# EAGLE design 5-channel-PWM (EAGLE 6.6.0)
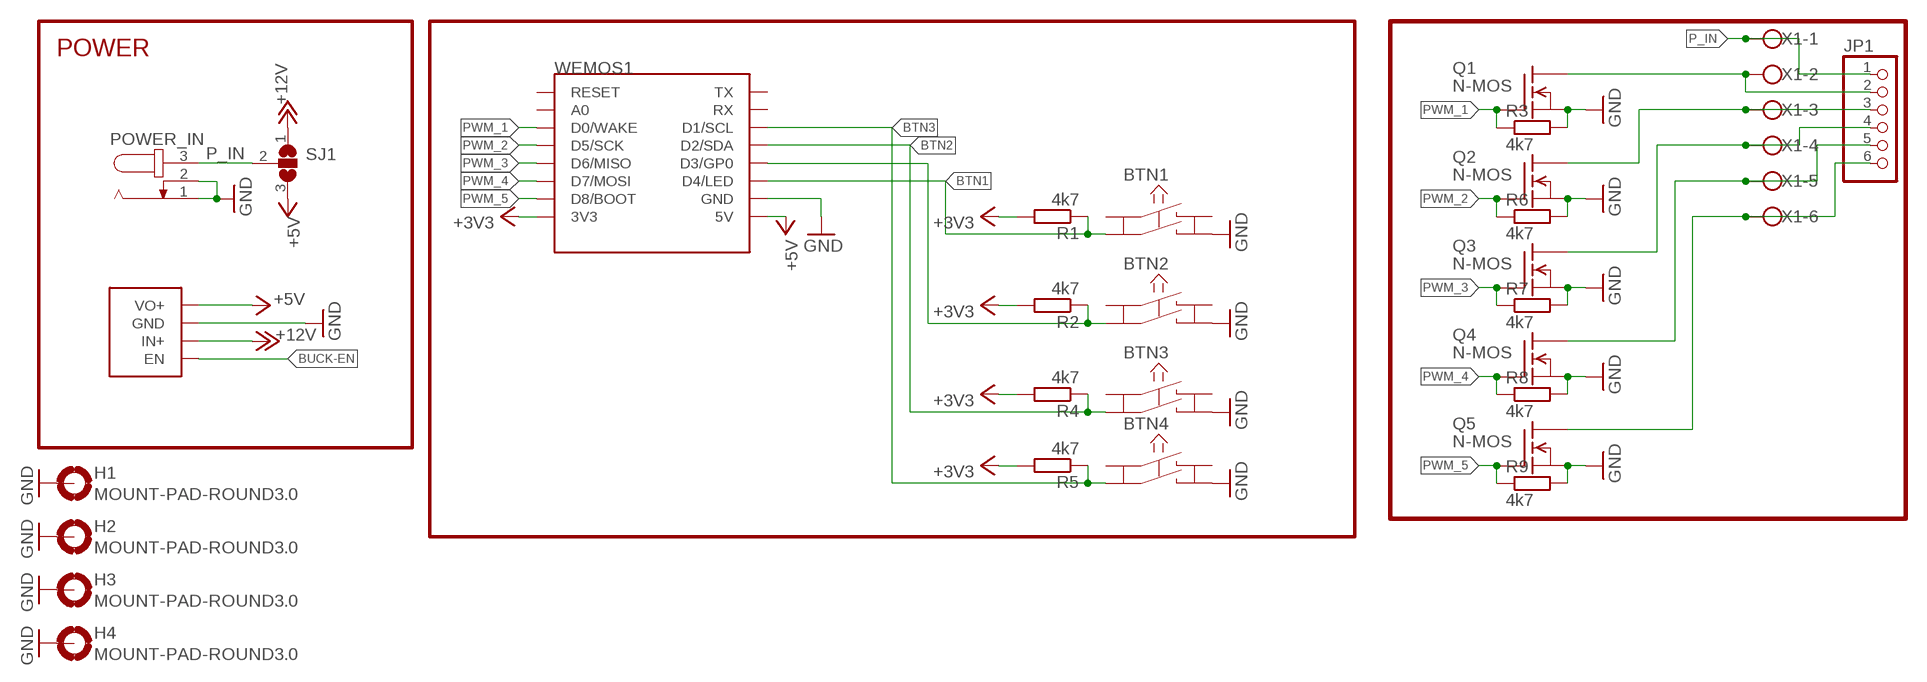
[diagram p0: schematic, sheet 1]

## Parts
BTN1  KSM611A  [KSM611A]
BTN2  KSM611A  [KSM611A]
BTN3  KSM611A  [KSM611A]
BTN4  KSM611A  [KSM611A]
H1  MOUNT-PAD-ROUND3.0  [3,0-PAD]
H2  MOUNT-PAD-ROUND3.0  [3,0-PAD]
H3  MOUNT-PAD-ROUND3.0  [3,0-PAD]
H4  MOUNT-PAD-ROUND3.0  [3,0-PAD]
JP1  PINHD-1X06_2.54-S  [1X06-S]
POWER_IN  RAPC7120  [RAPC712]
Q1  N-MOS  BUZ10  [TO220]
Q2  N-MOS  BUZ10  [TO220]
Q3  N-MOS  BUZ10  [TO220]
Q4  N-MOS  BUZ10  [TO220]
Q5  N-MOS  BUZ10  [TO220]
R1  4k7  R-EU_MULTI  [MULTI_RESISTOR]
R2  4k7  R-EU_MULTI  [MULTI_RESISTOR]
R3  4k7  R-EU_MULTI  [MULTI_RESISTOR]
R4  4k7  R-EU_MULTI  [MULTI_RESISTOR]
R5  4k7  R-EU_MULTI  [MULTI_RESISTOR]
R6  4k7  R-EU_MULTI  [MULTI_RESISTOR]
R7  4k7  R-EU_MULTI  [MULTI_RESISTOR]
R8  4k7  R-EU_MULTI  [MULTI_RESISTOR]
R9  4k7  R-EU_MULTI  [MULTI_RESISTOR]
SJ1  SJ2WW  [SJ_2W]
U$1  BUCK_CONVERTER_TE818  [BUCK_CONVERTER_TE818]
WEMOS1  WEMOS-D1-MINI  [WEMOS-D1-MINI]
X1  W237-136  [W237-136]

## Nets
+3V3: R1.2@1 R1.2@2 R2.2@1 R2.2@2 R4.2@1 R4.2@2 R5.2@1 R5.2@2 WEMOS1.3V3
+5V: SJ1.3 U$1.VO+ WEMOS1.5V
+12V: SJ1.1 U$1.IN+
BTN1: BTN1.C R1.1@1 R1.1@2 WEMOS1.D4(D4/LED)
BTN2: BTN3.C R4.1@1 R4.1@2 WEMOS1.D2(D2/SDA)
BTN3: BTN4.C R5.1@1 R5.1@2 WEMOS1.D1(D1/SCL)
BUCK-EN: U$1.EN
GND: BTN1.D BTN2.D BTN3.D BTN4.D H1.B3,0(MOUNT) H2.B3,0(MOUNT) H3.B3,0(MOUNT) H4.B3,0(MOUNT) POWER_IN.1 POWER_IN.2 Q1.3(S) Q2.3(S) Q3.3(S) Q4.3(S) Q5.3(S) R3.2@1 R3.2@2 R6.2@1 R6.2@2 R7.2@1 R7.2@2 R8.2@1 R8.2@2 R9.2@1 R9.2@2 U$1.GND WEMOS1.GND
N$1: JP1.2 Q1.2(D) X1.2
N$2: BTN2.C R2.1@1 R2.1@2 WEMOS1.D3(D3/GP0)
N$4: JP1.3 Q2.2(D) X1.3
N$5: JP1.4 Q3.2(D) X1.4
N$6: JP1.5 Q4.2(D) X1.5
N$9: JP1.6 Q5.2(D) X1.6
P_IN: JP1.1 POWER_IN.3 SJ1.2 X1.1
PWM_1: Q1.1(G) R3.1@1 R3.1@2 WEMOS1.D0(D0/WAKE)
PWM_2: Q2.1(G) R6.1@1 R6.1@2 WEMOS1.D5(D5/SCK)
PWM_3: Q3.1(G) R7.1@1 R7.1@2 WEMOS1.D6(D6/MISO)
PWM_4: Q4.1(G) R8.1@1 R8.1@2 WEMOS1.D7(D7/MOSI)
PWM_5: Q5.1(G) R9.1@1 R9.1@2 WEMOS1.D8(D8/BOOT)
Unconnected: BTN1.A BTN1.B BTN2.A BTN2.B BTN3.A BTN3.B BTN4.A BTN4.B WEMOS1.A0 WEMOS1.RESET WEMOS1.RX WEMOS1.TX

## Notes on the sheet
- POWER

## Library data of the parts
BTN1-BTN4 = schalter_taster:KSM611A
H1-H4 = holes:MOUNT-PAD-ROUND: MOUNTING PAD, round
JP1 = pinhead-2:PINHD-1X06: PIN HEADER
POWER_IN = Arduino Mega 2560:RAPC712: DC POWER JACK Power Jack, DC, Right Angle, Through Hole, Rated 5A at 16VDC, PC Terminals Distributor: Farnell (www.Farnell.de) Drawing: 84N1161.pdf / 84N1162.pdf Manufacturer: SPC Technology (www.spctechnology.com) Type: SPC4077 / SPC 4078
Q1-Q5 = transistor-fet:BUZ10: N-Channel Enhancement MOSFET 50V; 20A; 0,080Ohm
R1-R9 = diyHue:R-EU_MULTI
SJ1 = jumper:SJ2W: SMD solder JUMPER
U$1 = diyHue:BUCK_CONVERTER_TE818
WEMOS1 = esp8266modules:WEMOS-D1-MINI: WeMos.cc D1 mini ESP8266 module
X1 = con-wago-500:W237-136: WAGO SCREW CLAMP; MPN: 237-136; OC_FARNELL: unknown; OC_NEWARK: 84K9151

## Board
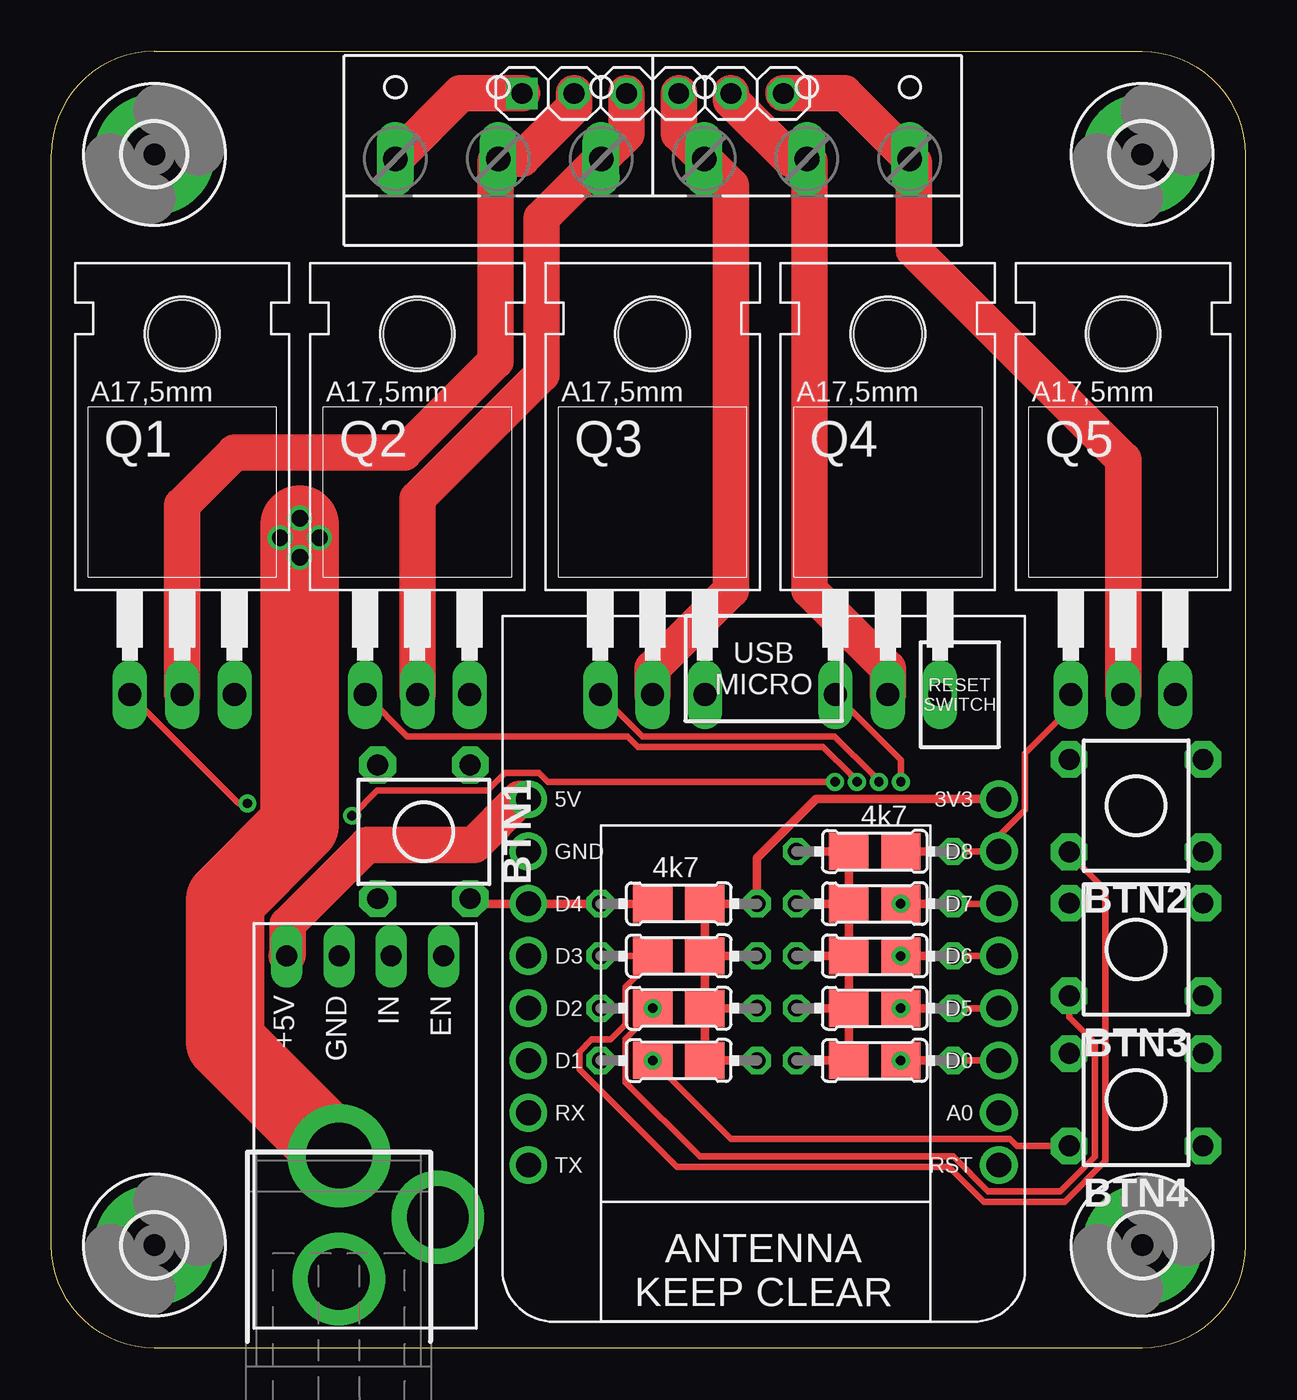
[diagram p1: board, top side]
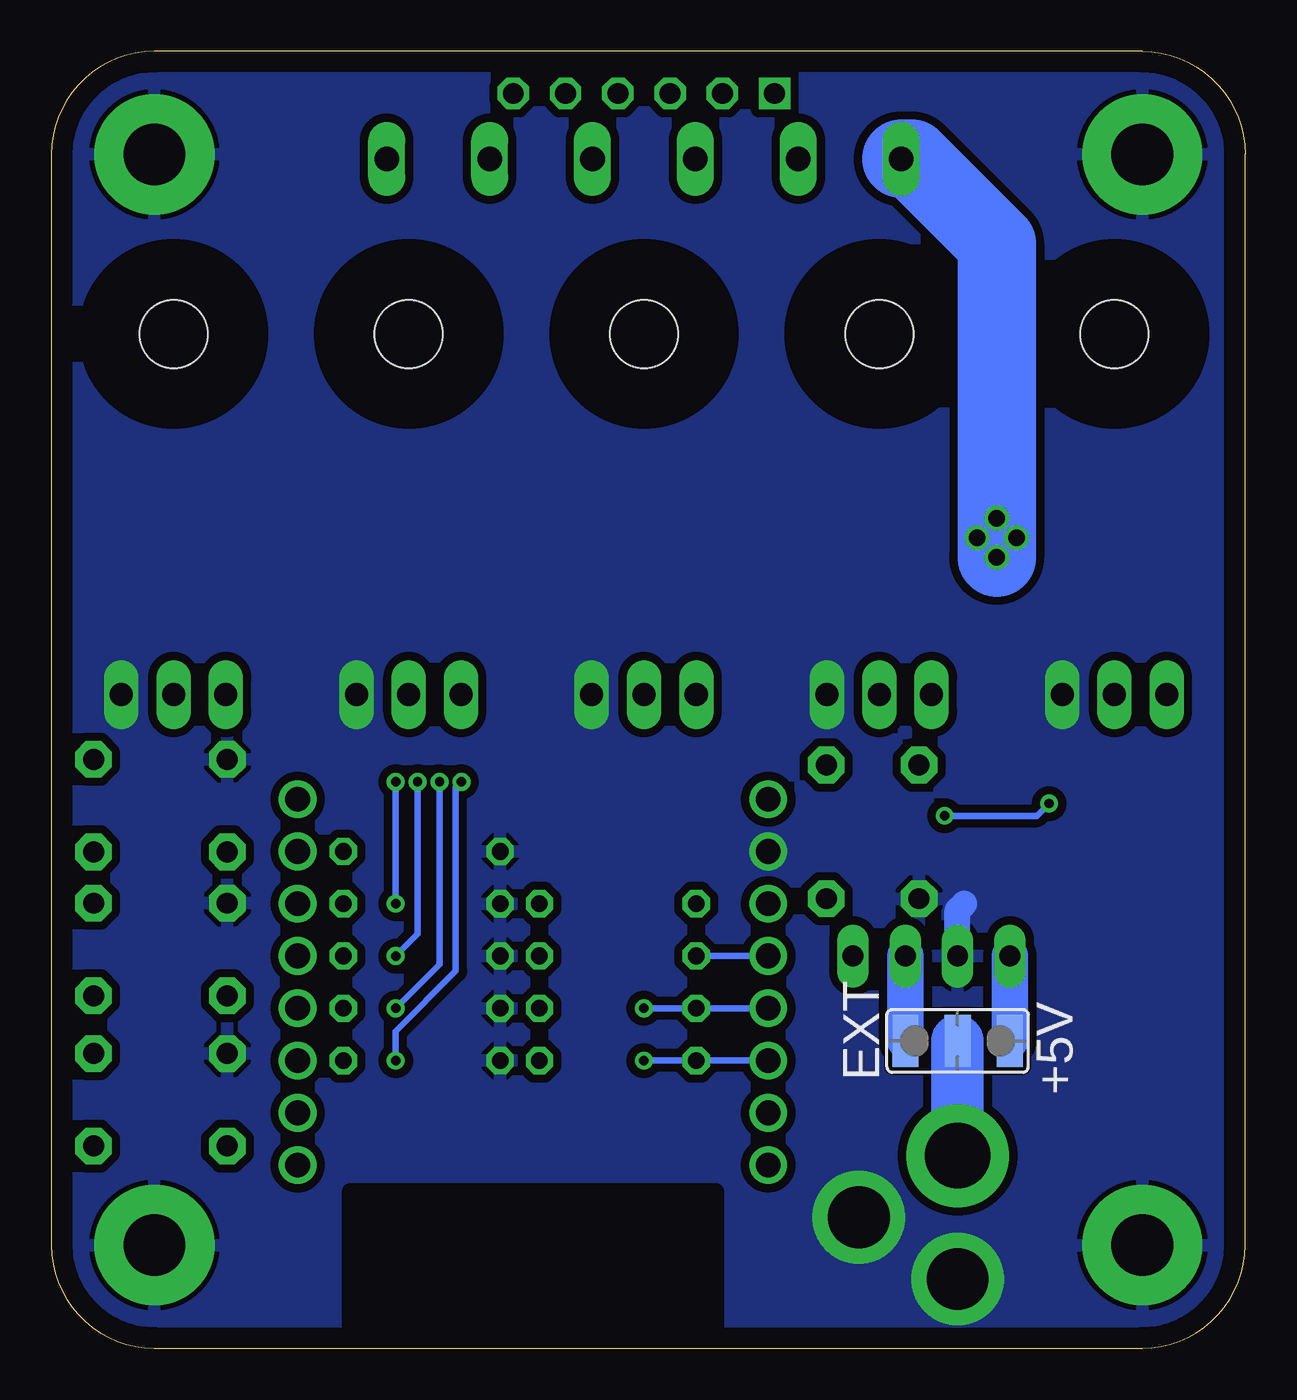
[diagram p2: board, bottom side, seen from below]

Size 58 x 63 mm. Coordinates in mm from the lower left corner, seen from the top.
Outline: 0,5 0,58 arc-90 5,63 53,63 arc-90 58,58 58,5 arc-90 53,0 5,0 arc-90 0,5
Copper layers (1*16): Top 0.035mm / dielectric 1.5mm / Bottom 0.035mm
Design rules "default *": minimum track width 10mil, minimum drill 18mil, track to track 8mil, track to pad 8mil, pad to pad 8mil, via to via 8mil, smd to smd 0mil, copper to edge 40mil, drill to drill 8mil, minimum pad ring 10mil, minimum via ring 8mil, stop-mask expansion 4mil, vias tented up to drill 30mil, thermal gap 10mil

### Footprints (pad centres in the part's own frame; a part is rotated, then mirrored left to right if it is on the bottom)
KSM611A = drill 1.016 pad 1.778 octagon: A -3.25,2.25; B -3.25,-2.25; C 3.25,2.25; D 3.25,-2.25
3,0-PAD = drill 3 pad 5.842: B3,0 0,0
1X06-S = drill 1.016 square: 1 -6.35,0 | drill 1.016 octagon: 2 -3.81,0; 3 -1.27,0; 4 1.27,0; 5 3.81,0; 6 6.35,0
RAPC712 = drill 3 pad 4.5: 1 -3,0; 2 0,-4.8 | drill 3.2 pad 5: 3 3,0
TO220 = drill 1.118 long: 1 -2.54,-6.35; 2 0,-6.35; 3 2.54,-6.35 | hole 3.302: 0,11.176
MULTI_RESISTOR = drill 0.813 octagon: 1@1 -3.81,0; 2@1 3.81,0 | smd 1.905 x 1.803: 1@2 -1.266,0; 2@2 1.266,0
SJ_2W = smd 1.27 x 2.54: 1 -2.54,0; 2 0,0; 3 2.54,0
BUCK_CONVERTER_TE818 = drill 1.016 long: EN 0,3.81; GND 0,-1.27; IN+ 0,1.27; VO+ 0,-3.81
WEMOS-D1-MINI = drill 1.2 pad 1.829: 3V3 -10.16,-10.16; 5V 12.7,-10.16; A0 -10.16,5.08; D0 -10.16,2.54; D1 12.7,2.54; D2 12.7,0; D3 12.7,-2.54; D4 12.7,-5.08; D5 -10.16,0; D6 -10.16,-2.54; D7 -10.16,-5.08; D8 -10.16,-7.62; GND 12.7,-7.62; RESET -10.16,7.62; RX 12.7,5.08; TX 12.7,7.62
W237-136 = drill 1.194 long: 1 -12.5,-1.27; 2 -7.5,-1.27; 3 -2.5,-1.27; 4 2.5,-1.27; 5 7.5,-1.27; 6 12.5,-1.27

### Placement (x,y rotation side)
BTN1  18.1,25.08 270 top
BTN2  52.7,26.35 180 top
BTN3  52.7,19.37 180 top
BTN4  52.7,12.06 180 top
H1  5,5 0 top
H2  53,5 0 top
H3  53,58 0 top
H4  5,58 0 top
JP1  29.21,60.96 0 top
POWER_IN  13.97,6.35 90 top
Q1  6.35,38.1 0 top
Q2  17.78,38.1 0 top
Q3  29.21,38.1 0 top
Q4  40.64,38.1 0 top
Q5  52.07,38.1 0 top
R1  30.48,21.59 0 top
R2  30.48,19.05 0 top
R3  40.01,13.97 180 top
R4  30.48,16.51 0 top
R5  30.48,13.97 0 top
R6  40.01,16.51 180 top
R7  40.01,19.05 180 top
R8  40.01,21.59 180 top
R9  40.01,24.13 180 top
SJ1  13.97,14.92 0 bottom
U$1  15.24,19.05 270 top
WEMOS1  35.88,16.51 180 top
X1  29.21,59.05 0 top

### Tracks (layer width: path | path; a pad name or v marks a point on that pad's centre or on a via)
+3V3
  Top 0.406: R4.2@2 R5.2@2 R5.2@1 | R4.2@2 R2.2@2 | R2.2@2 R1.2@2 R1.2@1 34.29,23.81 37.15,26.67 WEMOS1.3V3 | R4.2@2 R4.2@1 | R2.2@1 R2.2@2
+5V
  Top 1.778: WEMOS1.5V 22.76,26.67 20.54,24.45 15.34,24.45 11.48,20.59 11.48,19.1 U$1.VO+
  Bottom 1.778: SJ1.3 U$1.VO+
+12V
  Bottom 1.778: SJ1.1 U$1.IN+
BTN1
  Top 0.406: BTN1.C 20.59,21.59 WEMOS1.D4 R1.1@1 R1.1@2
BTN2  (via drill 0.46)
  Top 0.305: BTN3.C 49.45,16.07 50.7,14.83 50.7,9.3 49.02,7.62 45.51,7.62 43.82,9.31 31.52,9.31 27.91,12.92 27.91,15.02 29.21,16.33 R4.1@2
  Bottom 0.305: WEMOS1.D2 R4.1@1 R4.1@2
  other vias: 29.21,16.51
BTN3  (via drill 0.46)
  Top 0.305: BTN4.C 46.91,9.81 46.56,10.16 33.02,10.16 R5.1@2
  Bottom 0.305: WEMOS1.D1 R5.1@1 R5.1@2
  other vias: 29.21,13.97
GND
  Top 0.406: R8.2@2 R9.2@2 R9.2@1 | R8.2@2 R7.2@2 | R7.2@2 R6.2@2 | R6.2@2 R3.2@2 R3.2@1 | R6.2@2 R6.2@1 | R7.2@2 R7.2@1 | R8.2@2 R8.2@1
  Bottom 1.27: U$1.GND 13.97,21.27 13.65,21.59
  pour Bottom (isolate 0.406): -0.64,63.5 58.42,63.5 58.42,-0.64 -0.64,-0.64
  pour Bottom (isolate 0.406, no thermals): 10.79,8.89 21.27,8.89 21.27,-0.32 10.79,-0.32
  pour Bottom (isolate 0.406, no thermals): 41.59,29.53 44.45,29.53 44.45,33.97 41.59,33.97
  pour Bottom (isolate 0.406, no thermals): 53.02,29.53 55.88,29.53 55.88,33.97 53.02,33.97
  pour Bottom (isolate 0.406, no thermals): 30.48,29.53 33.34,29.53 33.34,33.97 30.48,33.97
  pour Bottom (isolate 0.406, no thermals): 19.05,29.53 21.91,29.53 21.91,33.97 19.05,33.97
  pour Bottom (isolate 0.406, no thermals): 25.4,22.54 25.4,25.4 20.95,25.4 20.95,22.54
  pour Bottom (isolate 0.406, no thermals): 7.62,29.53 10.48,29.53 10.48,33.97 7.62,33.97
N$1
  Top 1.778: Q1.2 6.35,40.96 8.89,43.5 17.14,43.5 21.59,47.94 21.59,57.66 X1.2 22.86,57.78 25.4,60.33 JP1.2
N$2
  Top 0.305: BTN2.C 49.45,24.01 51.21,22.26 51.21,9.09 49.23,7.11 45.3,7.11 43.61,8.8 30.4,8.8 25.65,13.55 25.65,14.39 26.25,14.99 27.15,14.99 27.91,15.74 27.91,17.56 29.21,18.87 R2.1@2 R2.1@1
  Bottom 0.305: WEMOS1.D3 R2.1@1
N$4
  Top 1.778: Q2.2 17.78,41.27 23.81,47.31 23.81,54.89 X1.3 27.94,59.02 JP1.3
N$5
  Top 1.778: Q3.2 29.21,33.02 33.02,36.83 33.02,56.48 X1.4 30.48,59.02 JP1.4
N$6
  Top 1.778: Q4.2 40.64,33.02 36.83,36.83 36.83,57.66 X1.5 35.88,57.78 33.02,60.64 JP1.5
N$9
  Top 1.778: Q5.2 52.07,43.18 41.91,53.34 41.91,57.59 X1.6 38.53,60.96 JP1.6
P_IN  (via drill 0.8)
  Top 0.254: v12.06,40.32 12.06,40.01
  Top 1.27: v13.02,39.37 12.06,39.37 v11.11,39.37
  Top 1.778: X1.1 19.89,60.96 JP1.1
  Top 3.81: 12.06,40.01 12.06,39.37 v12.06,38.42 12.06,25.41 8.43,21.78 8.43,14.89 POWER_IN.3
  Bottom 2.54: SJ1.2 POWER_IN.3
  Bottom 3.81: X1.1 16.19,57.78 12.06,53.66 v12.06,38.42
PWM_1  (via drill 0.46)
  Top 0.305: R3.1@1 WEMOS1.D0 | v38.08,27.51 24.14,27.51 23.7,27.94 22.03,27.94 21.18,27.09 15.83,27.09 v14.61,25.86 | v9.53,26.46 9.1,26.46 Q1.1
  Top 0.406: R3.1@2 R3.1@1
  Bottom 0.305: v38.08,27.51 38.35,27.23 38.35,18.31 41.27,15.4 R3.1@2 | v14.61,25.86 10.12,25.86 v9.53,26.46
  other vias: 41.27,13.97
PWM_2  (via drill 0.46)
  Top 0.305: R6.1@1 WEMOS1.D5 | v39.14,27.51 38.86,27.79 38.86,27.83 37.49,29.21 28.5,29.21 28,29.72 17.29,29.72 15.25,31.75 Q2.1
  Top 0.406: R6.1@2 R6.1@1
  Bottom 0.305: R6.1@2 39.14,18.64 v39.14,27.51
  other vias: 41.27,16.51
PWM_3  (via drill 0.46)
  Top 0.305: R7.1@1 WEMOS1.D6 | v40.21,27.51 39.93,27.79 39.93,27.83 38.05,29.72 28.72,29.72 26.68,31.75 Q3.1
  Top 0.406: R7.1@2 R7.1@1
  Bottom 0.305: R7.1@2 40.21,20.11 v40.21,27.51
  other vias: 41.27,19.05
PWM_4  (via drill 0.46)
  Top 0.305: R8.1@1 WEMOS1.D7 | v41.27,27.51 41.27,28.57 Q4.1
  Top 0.406: R8.1@2 R8.1@1
  Bottom 0.305: R8.1@2 v41.27,27.51
  other vias: 41.27,21.59
PWM_5
  Top 0.305: R9.1@1 WEMOS1.D8 46.04,24.87 47.31,26.14 47.31,28.89 49.53,31.11 Q5.1
  Top 0.406: R9.1@2 R9.1@1

### Text on the board
bPlace: +5V | EXT